# EAGLE board 000018 PGKB Rev 1.00 (EAGLE 9.3.0)
AUTHOR: Kallio Designs; DATE: 11.02.2019; PRODUCT_NUMBER: 000018; REVISION: 1.00; TITLE: PGKB
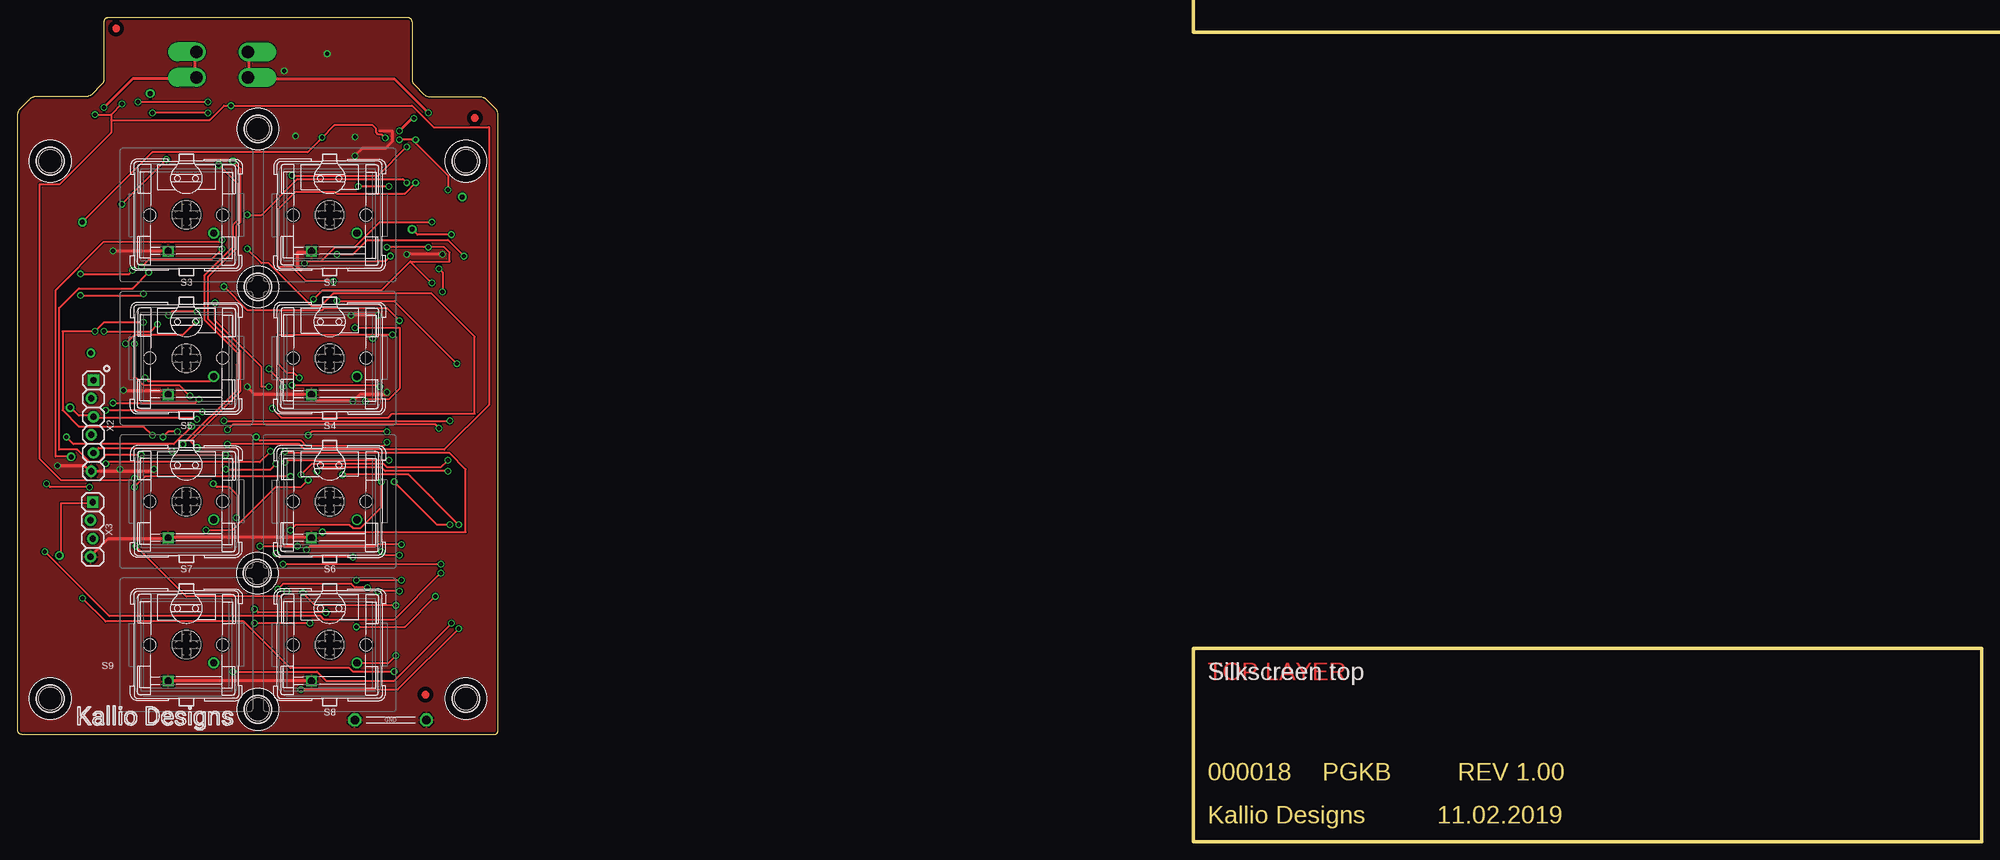
[diagram p8: board, top side]
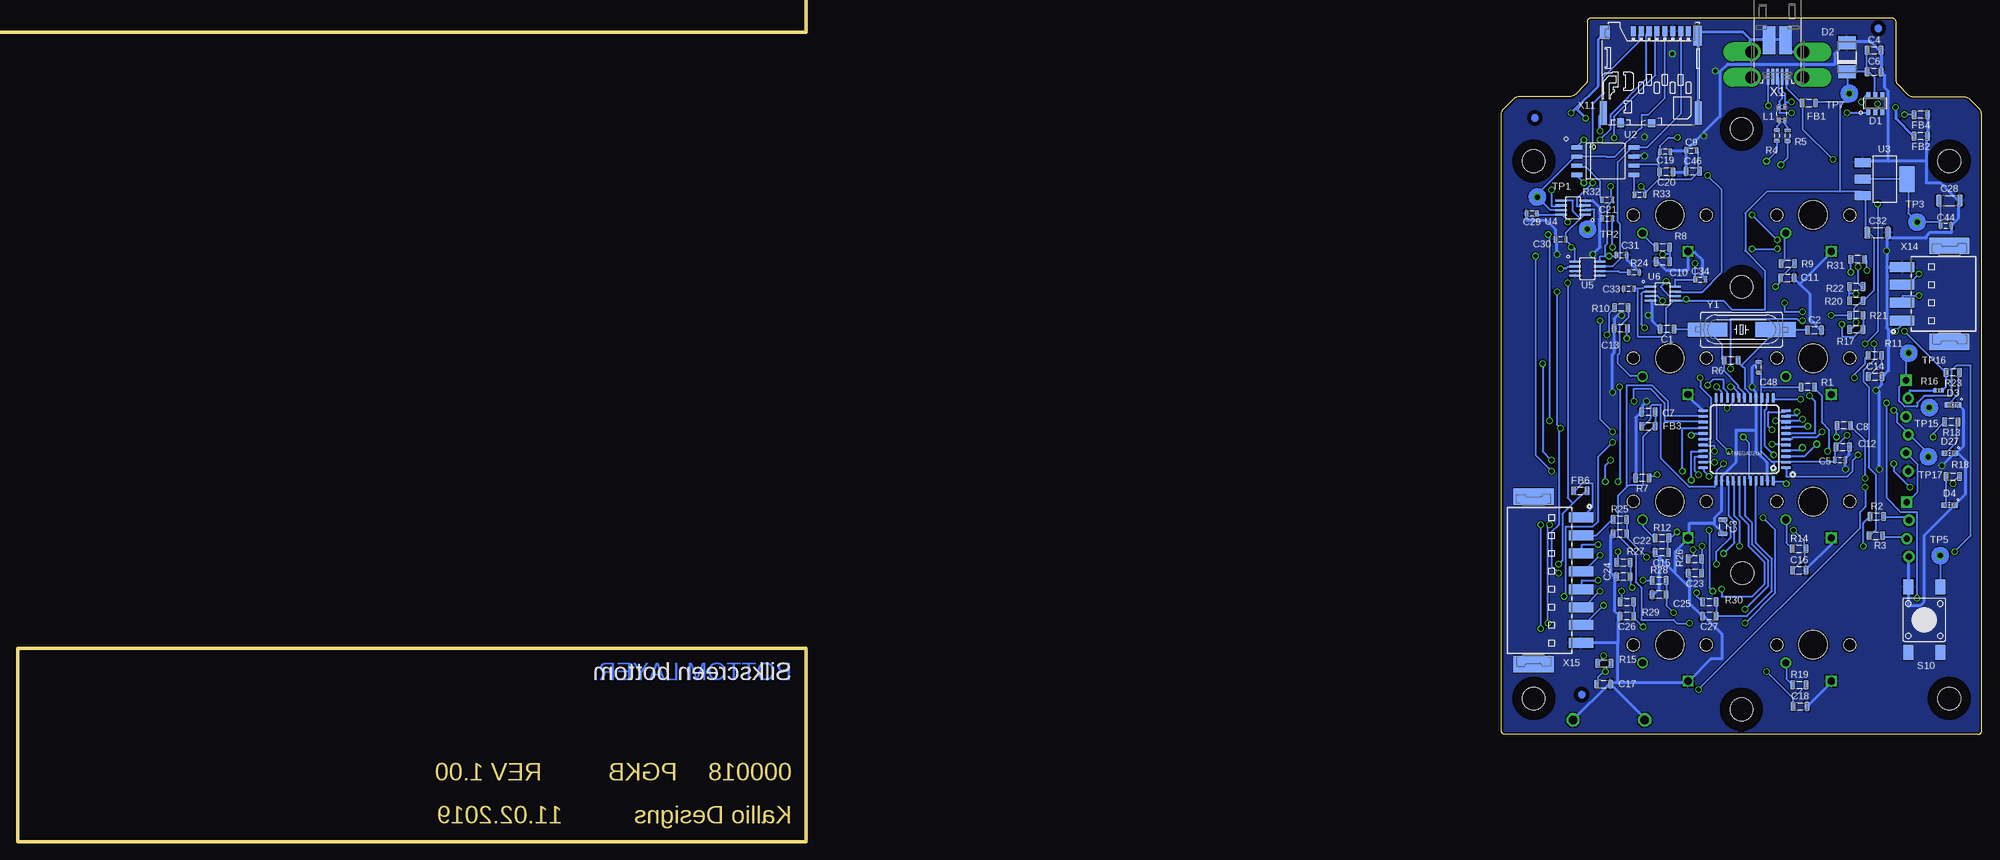
[diagram p9: board, bottom side, seen from below]

Size 274 x 115 mm. Coordinates in mm from the lower left corner, seen from the top.
Outline: 164,27 274,27 274,0 164,0 164,27
Outline: 55,114.5 55,106.5 arc45 55.35,105.65 56.65,104.35 arc45 57.5,104 64.5,104 arc-45 65.35,103.65 66.65,102.35 arc-45 67,101.5 67,15.5 arc-90 66.5,15 0.5,15 arc-90 0,15.5 0,101.5 arc-45 0.35,102.35 1.65,103.65 arc-45 2.5,104 9.5,104 arc45 10.35,104.35 11.65,105.65 arc45 12,106.5 12,114.5 arc-90 12.5,115 54.5,115 arc-90 55,114.5
Copper layers (1*16): Top 0.035mm / dielectric 1.5mm / Bottom 0.035mm
Design rules "ITEADstudio_DRC": minimum track width 6mil, minimum drill 12mil, track to track 6mil, track to pad 6mil, pad to pad 6mil, via to via 6mil, smd to smd 0mil, copper to edge 10mil, drill to drill 10mil, minimum pad ring 10mil, minimum via ring 6mil, stop-mask expansion 2mil, vias tented up to drill 100mil, thermal gap 10mil
Net classes: 0 default: width 0.15 mm; 1 PWR: width 0.4 mm; 2 +5V: drill 0.5 mm; 3 Serial: clearance 0.15 mm; 4 +3v3: drill 0.5 mm
Milling: 47 lines

## Footprints (pad centres in the part's own frame; a part is rotated, then mirrored left to right if it is on the bottom)
CAPC2012X160 = smd 0.7 x 1.3: P$1 -0.95,0; P$2 0.95,0
CAPC1608X90 = smd 0.5 x 0.9: P$1 -0.75,0; P$2 0.75,0
CAPC3216X200 = smd 0.9 x 1.7: P$1 -1.45,0; P$2 1.45,0
SOP95P280X120-6N = smd 0.55 x 0.8: 1 -0.95,-1.2; 2 0,-1.2; 3 0.95,-1.2; 4 0.95,1.2; 5 0,1.2; 6 -0.95,1.2
DIOC530X280X230_SMA_A = smd 1.8 x 2.4: A 2.025,0; C -2.025,0
LEDM1608X80N_DOME = smd 0.8 x 0.8: A -0.75,0; C 0.75,0
LEDM1608X80N = smd 0.8 x 0.8: A -0.75,0; C 0.75,0
RESC2012X50 = smd 0.7 x 1.3: P$1 -0.95,0; P$2 0.95,0
IND_CHOKE_EXC-34 = smd 0.75 x 0.4: A1 -0.925,0.4; A2 0.925,0.4; B1 -0.925,-0.4; B2 0.925,-0.4
RESC1608X45N = smd 0.5 x 0.9: P$1 -0.75,0; P$2 0.75,0
RESC1005X35N = smd 0.5 x 0.6: P$1 -0.5,0; P$2 0.5,0
SWITCH_BUTTON_CHERRY_MX = drill 1 square: 1 2.54,5.08 | drill 1: 2 -3.81,2.54 | hole 4: 0,0 | hole 1.7: 5.08,0; -5.08,0
SWITCH_BUTTON_TE_FSM4JSMA = smd 1.4 x 2.1: 1 2.25,4.55; 2 2.25,-4.55; 3 -2.25,4.55; 4 -2.25,-4.55
TEST_POINT_2.5MM_0.7HOLE_1SIDE = drill 0.7 pad 1.1: P$1 0,0
QFP80P1000X1000X120-44R_N = smd 1.4 x 0.45: 1 -5.8,4; 2 -5.8,3.2; 3 -5.8,2.4; 4 -5.8,1.6; 5 -5.8,0.8; 6 -5.8,0; 7 -5.8,-0.8; 8 -5.8,-1.6; 9 -5.8,-2.4; 10 -5.8,-3.2; 11 -5.8,-4; 23 5.8,-4; 24 5.8,-3.2; 25 5.8,-2.4; 26 5.8,-1.6; 27 5.8,-0.8; 28 5.8,0; 29 5.8,0.8; 30 5.8,1.6; 31 5.8,2.4; 32 5.8,3.2; 33 5.8,4 | smd 0.45 x 1.4: 12 -4,-5.8; 13 -3.2,-5.8; 14 -2.4,-5.8; 15 -1.6,-5.8; 16 -0.8,-5.8; 17 0,-5.8; 18 0.8,-5.8; 19 1.6,-5.8; 20 2.4,-5.8; 21 3.2,-5.8; 22 4,-5.8; 34 4,5.8; 35 3.2,5.8; 36 2.4,5.8; 37 1.6,5.8; 38 0.8,5.8; 39 0,5.8; 40 -0.8,5.8; 41 -1.6,5.8; 42 -2.4,5.8; 43 -3.2,5.8; 44 -4,5.8
SOP127P800X175-8 = smd 0.6 x 1.55: 1 -1.905,-4; 2 -0.635,-4; 3 0.635,-4; 4 1.905,-4; 5 1.905,4; 6 0.635,4; 7 -0.635,4; 8 -1.905,4
SOT223 = smd 1.219 x 2.235: 1 -2.311,-3.099; 2 0,-3.099; 3 2.311,-3.099 | smd 3.6 x 2.2: 4 0,3.099
SOP65P400X130-8 = smd 0.3 x 1.6: 1 -0.975,-1.7; 2 -0.325,-1.7; 3 0.325,-1.7; 4 0.975,-1.7; 5 0.975,1.7; 6 0.325,1.7; 7 -0.325,1.7; 8 -0.975,1.7
CON_USB_MICROB_UJ2-MIBH-4-SMT-TR_MAN = smd 2.2 x 0.4: D+ 8.1,0; D- 8.1,0.65; GND 8.1,-1.3; ID 8.1,-0.65; VBUS 8.1,1.3 | smd 3.9 x 1.8: G1 3,1.15; G2 3,-1.15 | drill 1.75 pad 2.2 offset: H1 8.2,3.6; H2 4.65,3.6; H3 4.65,-3.6; H4 8.2,-3.6
CON_PINHD_1X06_TH_OFFSET = drill 0.9 pad 1.6 square: 1 0.15,6.35 | drill 0.9 pad 1.6: 2 -0.15,3.81; 3 0.15,1.27; 4 -0.15,-1.27; 5 0.15,-3.81; 6 -0.15,-6.35
1X04_TH_OFFSET = drill 0.9 pad 1.6 square: 1 0.15,3.81 | drill 0.9 pad 1.6: 2 -0.15,1.27; 3 0.15,-1.27; 4 -0.15,-3.81
MTG_NP_M3_320X600 = hole 3.2: 0,0
CON_MICROSD_MOLEX_5033981892_M = smd 0.7 x 1.4: 1 4.405,-0.75; 2 5.505,-0.75; 3 6.605,-0.75; 4 7.705,-0.75; 5 8.805,-0.75; 6 9.905,-0.75; 7 11.005,-0.75; 8 12.105,-0.75 | smd 0.9 x 1.23: DET_LVR 2.66,-13.515 | smd 1.05 x 1.088: DET_SW 6.925,-13.59 | smd 1.44 x 1.83: H1 0.42,-0.915 | smd 1 x 3.33: H2 0.2,-12.165; H4 13.46,-12.165 | smd 1.16 x 2.8: H3 13.38,-1.4
PAD_GND_HOOK_M = drill 1.2 pad 1.8 octagon: P$1 -5,0; P$2 5,0
CON_PHOENIX_CONTACT_1702474 = smd 1.4 x 3.4: 1 -3.75,6.6; 2 -1.25,6.6; 3 1.25,6.6; 4 3.75,6.6 | smd 2.3 x 5.6: H1 -6.7,0; H2 6.7,0
CON_PHOENIX_CONTACT_1771088 = smd 1.4 x 3.4: 1 -8.75,6.6; 2 -6.25,6.6; 3 -3.75,6.6; 4 -1.25,6.6; 5 1.25,6.6; 6 3.75,6.6; 7 6.25,6.6; 8 8.75,6.6 | smd 2.3 x 5.6: H1 -11.7,0; H2 11.7,0
OSC_CRYSTAL_HC49/US = smd 5.6 x 2.1: 1 -4.75,0 | smd 5.5 x 2: 2 4.75,0

## Placement (x,y rotation side)
C1  C0805_18PF_50V_NP0  [CAPC2012X160]  43.89,71.59 180 bottom
C2  C0805_18PF_50V_NP0  [CAPC2012X160]  23.3,71.41 0 bottom
C3  C0805_1UF_50V_X5R  [CAPC2012X160]  36.09,43.99 270 bottom
C4  C0805_1UF_50V_X5R  [CAPC2012X160]  15,110.5 0 bottom
C5  C0603_100NF_50V_X7R  [CAPC1608X90]  19.75,53.3 0 bottom
C6  C0805_10NF_50V_X7R  [CAPC2012X160]  15,107.5 0 bottom
C7  C0805_1UF_50V_X5R  [CAPC2012X160]  46.5,60 180 bottom
C8  C0805_1UF_50V_X5R  [CAPC2012X160]  19.25,58.09 180 bottom
C9  C0603_100NF_50V_X7R  [CAPC1608X90]  40.5,96.5 0 bottom
C10  C0805_1NF_50V_X7R  [CAPC2012X160]  44.5,81 180 bottom
C11  C0805_1NF_50V_X7R  [CAPC2012X160]  27.09,78.73 0 bottom
C12  C0805_4.7UF_25V_X5R  [CAPC2012X160]  19.38,55.13 0 bottom
C13  C0805_1NF_50V_X7R  [CAPC2012X160]  50.33,71.67 180 bottom
C14  C0805_1NF_50V_X7R  [CAPC2012X160]  14.86,64.93 0 bottom
C15  C0805_1NF_50V_X7R  [CAPC2012X160]  44.64,40.39 180 bottom
C16  C0805_1NF_50V_X7R  [CAPC2012X160]  25.45,37.91 0 bottom
C17  C0805_1NF_50V_X7R  [CAPC2012X160]  52.74,22.01 0 bottom
C18  C0805_1NF_50V_X7R  [CAPC2012X160]  25.33,18.91 0 bottom
C19  C0603_100NF_50V_X7R  [CAPC1608X90]  44.15,96.3 180 bottom
C20  C0805_1UF_50V_X5R  [CAPC2012X160]  44,93.5 180 bottom
C21  C0603_100NF_50V_X7R  [CAPC1608X90]  52.25,87 0 bottom
C22  C0805_1NF_50V_X7R  [CAPC2012X160]  50.5,43 180 bottom
C23  C0805_1NF_50V_X7R  [CAPC2012X160]  40,37.5 180 bottom
C24  C0805_1NF_50V_X7R  [CAPC2012X160]  50,37 180 bottom
C25  C0805_1NF_50V_X7R  [CAPC2012X160]  45,34.5 180 bottom
C26  C0805_1NF_50V_X7R  [CAPC2012X160]  49.5,31.5 180 bottom
C27  C0805_1NF_50V_X7R  [CAPC2012X160]  38,31.5 180 bottom
C28  C1206_10UF_16V_Y5V  [CAPC3216X200]  4.5,89.5 0 bottom
C29  C0603_100NF_50V_X7R  [CAPC1608X90]  62.75,87.7 180 bottom
C30  C0603_100NF_50V_X7R  [CAPC1608X90]  58.75,84.1 0 bottom
C31  C0603_100NF_50V_X7R  [CAPC1608X90]  50.25,81.9 0 bottom
C32  C1206_10UF_16V_Y5V  [CAPC3216X200]  14.5,85 0 bottom
C33  C0603_100NF_50V_X7R  [CAPC1608X90]  49.25,77.2 0 bottom
C34  C0603_100NF_50V_X7R  [CAPC1608X90]  39.25,78.5 0 bottom
C44  C0603_100NF_50V_X7R  [CAPC1608X90]  5,86 0 bottom
C46  C0805_1UF_50V_X5R  [CAPC2012X160]  40.3,93.6 0 bottom
C48  C0603_100NF_50V_X7R  [CAPC1608X90]  31.1,66.25 90 bottom
D1  DIODE_TVS_5V_BI_824015  [SOP95P280X120-6N]  14.83,103.05 0 bottom
D2  DIODE_TVS_5V_SMAJ5.0A  [DIOC530X280X230_SMA_A]  18.78,109.52 90 bottom
D3  LED_0603_GREEN_CLEAR_APTD1608CGCK  [LEDM1608X80N_DOME]  4,61 0 bottom
D4  LED_0603_AMBER_DIFF_LOQ976-PS-25  [LEDM1608X80N]  4.5,47 0 bottom
D27  LED_0603_AMBER_DIFF_LOQ976-PS-25  [LEDM1608X80N]  4.44,54.25 0 bottom
ENCLOSURE1  ENCLOSURE_BOPLA_BOP-500-9005-TOP  [ENCLOSURE_BOPLA_BOP-500-9005]  33.5,57.5 180 top
FB1  FERRITE_0805_0A5  [RESC2012X50]  24.09,103.13 0 bottom
FB2  FERRITE_0805_0A5  [RESC2012X50]  8.5,98.5 180 bottom
FB3  FERRITE_0805_0A5  [RESC2012X50]  46.5,58 0 bottom
FB4  FERRITE_0805_0A5  [RESC2012X50]  8.5,101.5 180 bottom
FB6  FERRITE_0805_0A5  [RESC2012X50]  56,49 0 bottom
FIDUCIAL1  FIDUCIAL  [FIDUCIAL]  14.41,113.53 0 bottom
FIDUCIAL2  FIDUCIAL  [FIDUCIAL]  56.87,20.53 0 top
FIDUCIAL3  FIDUCIAL  [FIDUCIAL]  62.33,101.03 0 bottom
FIDUCIAL4  FIDUCIAL  [FIDUCIAL]  55.79,20.53 0 bottom
FIDUCIAL5  FIDUCIAL  [FIDUCIAL]  63.75,101.03 0 top
FIDUCIAL6  FIDUCIAL  [FIDUCIAL]  13.71,113.53 0 top
H1  SWITCH_CAP_DSA_RELEG  [SWITCH_CAP_DSA_RELEG]  23.5,67.5 180 top
H2  SWITCH_CAP_DSA_RELEG  [SWITCH_CAP_DSA_RELEG]  43.5,67.5 180 top
H3  SWITCH_CAP_DSA_RELEG  [SWITCH_CAP_DSA_RELEG]  43.5,87.5 180 top
H4  SWITCH_CAP_DSA_RELEG  [SWITCH_CAP_DSA_RELEG]  43.5,47.5 180 top
H5  SWITCH_CAP_DSA_RELEG  [SWITCH_CAP_DSA_RELEG]  43.5,27.5 180 top
H6  SWITCH_CAP_DSA_RELEG  [SWITCH_CAP_DSA_RELEG]  23.5,27.5 180 top
H7  SWITCH_CAP_DSA_RELEG  [SWITCH_CAP_DSA_RELEG]  23.5,87.5 180 top
H8  SWITCH_CAP_DSA_RELEG  [SWITCH_CAP_DSA_RELEG]  23.5,47.5 180 top
L1  L_CHOKE_EXC-34CE670U  [IND_CHOKE_EXC-34]  27.85,101.63 90 bottom
LOGO2  ART_LOGO_TEXT_2.5MM-SILK  [ART_LOGO_TEXT_2.5MM_SILK]  19.56,17.52 0 top
R1  R0805_10K_5%  [RESC2012X50]  24.26,63.49 180 bottom
R2  R0805_1K_1%  [RESC2012X50]  14.63,45.41 0 bottom
R3  R0805_1K_1%  [RESC2012X50]  14.76,42.72 0 bottom
R4  R0603_22  [RESC1608X45N]  28.58,98.58 270 bottom
R5  R0603_22  [RESC1608X45N]  27.08,98.54 270 bottom
R6  R0805_1M_5%  [RESC2012X50]  34.95,67.22 0 bottom
R7  R0805_10K_5%  [RESC2012X50]  47.36,50.78 180 bottom
R8  R0805_200_1%  [RESC2012X50]  44.5,83 0 bottom
R9  R0805_200_1%  [RESC2012X50]  27.02,80.72 0 bottom
R10  R0805_200_1%  [RESC2012X50]  50.29,74.59 180 bottom
R11  R0805_200_1%  [RESC2012X50]  14.9,67.91 0 bottom
R12  R0805_200_1%  [RESC2012X50]  44.59,42.41 0 bottom
R13  R0805_1K_1%  [RESC2012X50]  4.22,58.59 180 bottom
R14  R0805_200_1%  [RESC2012X50]  25.47,40.91 0 bottom
R15  R0805_200_1%  [RESC2012X50]  52.66,24.91 0 bottom
R16  R0402_DNP  [RESC1005X35N]  6,63 0 bottom
R17  R0805_3K3_1%  [RESC2012X50]  17.5,71.5 180 bottom
R18  R0805_1K_1%  [RESC2012X50]  4,51 0 bottom
R19  R0805_200_1%  [RESC2012X50]  25.42,21.91 0 bottom
R20  R0805_3K3_1%  [RESC2012X50]  17.5,75.5 0 bottom
R21  R0805_200_1%  [RESC2012X50]  17.5,73.5 180 bottom
R22  R0805_200_1%  [RESC2012X50]  17.5,77.5 0 bottom
R23  R0805_1K_1%  [RESC2012X50]  4,65.5 180 bottom
R24  R0603_0  [RESC1608X45N]  48.5,79.5 0 bottom
R25  R0805_1K_1%  [RESC2012X50]  50.5,45 0 bottom
R26  R0805_1K_1%  [RESC2012X50]  40,39.5 0 bottom
R27  R0805_1K_1%  [RESC2012X50]  50,39 0 bottom
R28  R0805_1K_1%  [RESC2012X50]  45,36.5 0 bottom
R29  R0805_1K_1%  [RESC2012X50]  49.5,33.5 0 bottom
R30  R0805_1K_1%  [RESC2012X50]  38,33.5 0 bottom
R31  R0805_200_1%  [RESC2012X50]  17.3,81.3 180 bottom
R32  R0603_0  [RESC1608X45N]  52.25,89.6 0 bottom
R33  R0603_0  [RESC1608X45N]  47.75,90.3 0 bottom
S1  SWITCH_BUTTON_MX1A-C1NW  [SWITCH_BUTTON_CHERRY_MX]  43.5,87.5 180 top
S3  SWITCH_BUTTON_MX1A-C1NW  [SWITCH_BUTTON_CHERRY_MX]  23.5,87.5 180 top
S4  SWITCH_BUTTON_MX1A-C1NW  [SWITCH_BUTTON_CHERRY_MX]  43.5,67.5 180 top
S5  SWITCH_BUTTON_MX1A-C1NW  [SWITCH_BUTTON_CHERRY_MX]  23.5,67.5 180 top
S6  SWITCH_BUTTON_MX1A-C1NW  [SWITCH_BUTTON_CHERRY_MX]  43.5,47.5 180 top
S7  SWITCH_BUTTON_MX1A-C1NW  [SWITCH_BUTTON_CHERRY_MX]  23.5,47.5 180 top
S8  SWITCH_BUTTON_MX1A-C1NW  [SWITCH_BUTTON_CHERRY_MX]  43.5,27.5 180 top
S9  SWITCH_BUTTON_MX1A-C1NW  [SWITCH_BUTTON_CHERRY_MX]  23.5,27.5 180 top
S10  SWITCH_MOM_SPST_FSM4JSMA  [SWITCH_BUTTON_TE_FSM4JSMA]  8,31 0 bottom
TP1  PAD_TEST_POINT-2.5/0.7_A  [TEST_POINT_2.5MM_0.7HOLE_1SIDE]  62,90 0 bottom
TP2  PAD_TEST_POINT-2.5/0.7_A  [TEST_POINT_2.5MM_0.7HOLE_1SIDE]  55,85.5 0 bottom
TP3  PAD_TEST_POINT-2.5/0.7_A  [TEST_POINT_2.5MM_0.7HOLE_1SIDE]  9,86.5 180 bottom
TP5  PAD_TEST_POINT-2.5/0.7_A  [TEST_POINT_2.5MM_0.7HOLE_1SIDE]  5.78,39.94 90 bottom
TP7  PAD_TEST_POINT-2.5/0.7_A  [TEST_POINT_2.5MM_0.7HOLE_1SIDE]  18.47,104.45 270 bottom
TP15  PAD_TEST_POINT-2.5/0.7_A  [TEST_POINT_2.5MM_0.7HOLE_1SIDE]  7.28,60.6 270 bottom
TP16  PAD_TEST_POINT-2.5/0.7_A  [TEST_POINT_2.5MM_0.7HOLE_1SIDE]  10.18,68.22 0 bottom
TP17  PAD_TEST_POINT-2.5/0.7_A  [TEST_POINT_2.5MM_0.7HOLE_1SIDE]  7.42,53.74 270 bottom
U1  IC_MCU_ATMEGA32U4-AU  [QFP80P1000X1000X120-44R_N]  33.06,56.19 180 bottom
U2  IC_MEM_FLASH_AT45DB321E  [SOP127P800X175-8]  52.5,95 270 bottom
U3  IC_REG_3V3_1A_NCP1117LPST33T3G  [SOT223]  13.5,92.5 270 bottom
U4  IC_LEVEL_SHIFTER_SN74LVC2T45  [SOP65P400X130-8]  57,88.5 90 bottom
U5  IC_LEVEL_SHIFTER_SN74LVC2T45  [SOP65P400X130-8]  55,80 270 bottom
U6  IC_LEVEL_SHIFTER_SN74LVC2T45  [SOP65P400X130-8]  44.5,76.5 270 bottom
X1  CON_USB_MICROB_UJ2-MIBH-4-SMT-TR-MAN  [CON_USB_MICROB_UJ2-MIBH-4-SMT-TR_MAN]  28.5,114.9 270 bottom
X2  CON_PROG_AVR_ISP-OFFSET_1X06  [CON_PINHD_1X06_TH_OFFSET]  10.38,58.08 0 top
X3  CON_1X04_TH_OFFSET_PADS-SILK  [1X04_TH_OFFSET]  10.29,43.59 0 top
X4  HOL_3.2/6.0_NP  [MTG_NP_M3_320X600]  62.5,20 180 top
X5  HOL_3.2/6.0_NP  [MTG_NP_M3_320X600]  33.5,18.5 180 top
X6  HOL_3.2/6.0_NP  [MTG_NP_M3_320X600]  4.5,95 180 top
X9  HOL_3.2/6.0_NP  [MTG_NP_M3_320X600]  4.5,20 180 top
X10  HOL_3.2/6.0_NP  [MTG_NP_M3_320X600]  62.5,95 180 top
X11  CON_MICROSD_MOLEX_5033981892-M  [CON_MICROSD_MOLEX_5033981892_M]  53,113.9 0 bottom
X12  HOL_3.2/6.0_NP  [MTG_NP_M3_320X600]  33.5,99.5 180 top
X13  PAD_TEST_GROUND_HOOK  [PAD_GND_HOOK_M]  52,17 180 top
X14  CON_CLAMP_PTSM_1X04_H_SMD  [CON_PHOENIX_CONTACT_1702474]  4.5,76.5 90 bottom
X15  CON_CLAMP_PTSM_1X08_H_SMD  [CON_PHOENIX_CONTACT_1771088]  62.5,36.5 270 bottom
X17  HOL_3.2/6.0_NP  [MTG_NP_M3_320X600]  33.4,37.48 180 top
X18  HOL_3.2/6.0_NP  [MTG_NP_M3_320X600]  33.48,77.48 180 top
Y1  OSC_CRYSTAL_16M_ABLS-16.000MHZ-B4-T-HC49  [OSC_CRYSTAL_HC49/US]  33.5,71.5 180 bottom

## Tracks (layer width: path | path; a pad name or v marks a point on that pad's centre or on a via)
!CS!_FLASH_3V3  (via drill 0.61)
  Top 0.254: v55.5,92 54,90.5 44.5,90.5 44.25,90.75 38.75,90.75 36.25,88.25 36.25,80.25 38.25,80.25 40.25,78.25 v44,78.25
  Bottom 0.254: U6.6 43.57,76.17 44.5,77.11 44.5,77.19 44.78,77.47 v44,78.25 | v55.5,92 56.5,93 U2.4
!CS!_FLASH_5V  (via drill 0.61)
  Top 0.254: v39.5,51.25 41,52.75 51,52.75 51.5,52.25 59,52.25 v60,53.25 | v61.25,66.75 52.5,75.5 v44.5,75.5
  Bottom 0.254: v39.5,51.25 40,51.75 40,53.75 39,53.75 U1.31 | v60,53.25 61.25,54.5 v61.25,66.75 | v44.5,75.5 45.25,76.25 46,76.25 U6.3
!CS!_SD_3V3  (via drill 0.61)
  Top 0.254: v54.25,97 50.25,93 v38.25,93
  Bottom 0.254: v54.25,97 54.25,103 52.75,104.5 52.75,106.75 47.75,111.75 47.75,112.75 47.5,113 X11.2 | v38.25,93 36.25,91 36.25,79.5 39,76.75 42.75,76.75 U6.7
!CS!_SD_5V  (via drill 0.61)
  Top 0.254: v48.5,61.5 48.75,61.75 51.75,61.75 53.25,63.25 53.25,71.75 v47,71.75
  Bottom 0.254: v48.5,61.5 48.5,63.25 46.25,63.25 44.25,61.25 44.25,58.75 39,58.75 U1.25 | v47,71.75 47.5,72.25 47.5,76.5 47.25,76.75 46.25,76.75 U6.2
!RESET  (via drill 0.61)
  Top 0.254: TP5.P$1 6,40 6,47.25 10.25,47.25 X3.1 | X2.5 10.75,54.5 11.25,55 21,55 v21.5,54.5 22,54 v29,54
  Bottom 0.254: S10.1 5.75,39.75 TP5.P$1 | v21.5,54.5 21.25,54.75 21.25,57.5 22.25,58.5 22.25,62.25 23.25,63.25 R1.P$1 | v29,54 30.25,55.25 30.25,60.25 30,60.5 30,61.75 U1.13 | X3.1 10.25,47.5 9,48.75 9,52.75 10.5,54.25 X2.5
!RESET!_3V3
  Bottom 0.254: R32.P$1 53,89.75 53.25,90 53.25,92.25 55.25,94.25 56.5,94.25 U2.3
+3V3  (via drill 0.61)
  Top 0.254: v40,80.75 40.25,81 42.25,81 | 42.25,81 51.25,81 v52,81.75 | v57.75,86.5 50.5,86.5 47,83 44.25,83 42.25,81 | TP3.P$1 18.75,96.25 40.4,96.25 v42.45,98.3 44.15,100 49.5,100 49.97,99.53 49.97,99.03 50.28,98.72 50.78,98.72 v51.25,98.25 | v47.5,91.5 v51.75,91.5
  Bottom 0.254: C29.P$1 62,87.5 58.75,87.5 U4.8 58.5,87.5 57.75,86.75 v57.75,86.5 | U6.8 42.75,77.5 42.75,78.5 C34.P$1 v40,80.75 | 52.5,81.75 53.25,81.75 53.25,81 U5.8 | 52.5,81.75 v52,81.75 51,81.75 C31.P$1 | 52.5,81.75 52.5,83.25 52.25,83.5 52.25,88.75 51.5,89.5 R32.P$2 51.5,89.75 51.75,90 v51.75,91.5 | 5.75,86.5 5.75,89.5 C28.P$1 | 5.75,86.5 C44.P$1 | 5.75,86.5 TP3.P$1 10.25,87.75 10.25,92.5 U3.4 U3.2 | C9.P$2 39.5,96.25 39.5,93.75 C46.P$2 39.5,93.5 40.5,92.5 45,92.5 | 45,93.5 45,94.5 | 45,94.5 45,96.25 C19.P$2 44.9,97.1 43.7,98.3 v42.45,98.3 | 45,92.5 46.75,90.75 | 46.75,90.75 47,90.5 R33.P$2 | 45,93.5 45,92.5 | 45,93.5 C20.P$2 | v51.25,98.25 51.25,101.25 45.5,107 45.5,113 X11.4 | 45,94.5 48.5,94.5 U2.6 | 46.75,90.75 v47.5,91.5
+5V  (via drill 0.61)
  Top 0.254: v36,52.75 35.25,52 v29,52 | v59,38.75 v37,38.75 | v51.5,83 v57.25,83 59.5,83 60.25,82.25 60.25,81 54.75,81 | v17.5,72.5 12,72.5 v10.75,71.25 6.25,71.25 6.25,60.25 8.5,58 17.5,58 v18.75,56.75 | 54.75,81 50.75,77 42.5,77 v41.25,75.75 | 54.75,81 v57.75,78
  Bottom 0.254: FB3.P$1 47.25,58 46.25,59 46.25,60.75 46,61 44.75,61 44.75,53.5 40.75,49.5 37.25,49.5 37.25,50.25 U1.34 37,50.5 37,51.75 v36,52.75 | 30.75,63.5 30.75,62 U1.14 30.75,61.75 30.75,54.5 29.25,53 29,53 | 30.75,63.5 30.75,65.25 31,65.5 C48.P$1 | 30.75,63.5 25.25,63.5 R1.P$2 | 29,53 27.5,53 U1.2 20.5,53 C5.P$1 20.5,55 C12.P$1 20.25,55.25 v18.75,56.75 | 29,53 v29,52 | v37,38.75 37,40.5 35,42.5 35,43.75 36,44.75 C3.P$1 | v59,38.75 58.5,39.25 58.5,45.75 57,47.25 | 57,47.25 55.25,49 FB6.P$2 | 57,83 56.75,82.75 56.75,81 U5.1 | 57,83 58,84 C30.P$2 58,85 56,87 | v51.5,83 C21.P$2 | 57,83 v57.25,83 | 56,87 55.5,87.5 U4.1 | 56,87 57,88 57,89.5 58.5,89.5 U4.5 | 19.75,103.25 18.5,103.25 18.5,104.25 TP7.P$1 18.5,104.5 18.75,104.75 18.75,107.25 D2.C 18.75,107.5 16,107.5 | 19.75,103.25 23,103.25 FB1.P$2 | D1.5 15,104.25 15,106.75 15.75,107.5 C6.P$1 16,107.5 | 16,107.5 16,110.5 C4.P$1 | 48,77.25 47.25,77.25 47,77.5 46.25,77.5 U6.1 | 48,77.25 48.5,77.25 C33.P$2 | 48,77.25 48,70.5 44.5,70.5 44,71 44,74.5 43,75.5 U6.5 42.75,75.5 41.25,75.5 | R16.P$2 5,63.5 5,65.5 | 17.75,72.5 17.75,72 18.25,71.5 R17.P$2 | 17.75,72.5 17.75,74.5 16.75,75.5 R20.P$2 16.5,75.5 15,77 15,84.25 15.75,85 C32.P$1 16,85 16.25,85.25 16.25,89.75 16.5,90 U3.3 16.75,90.25 16.75,90.75 19.75,90.75 | v10.75,71.25 5,65.5 | 17.75,72.5 v17.5,72.5 | 5,65.5 R23.P$2 | 41.25,75.5 36,75.5 34.75,74.25 30.25,74.25 30.25,79.75 33,82.5 33,87.75 30,90.75 19.75,90.75 | 19.75,90.75 19.75,103.25 | 41.25,75.5 v41.25,75.75 | 57,47.25 57.75,48 v57.75,78
AD0  (via drill 0.61)
  Top 0.254: v36,40.25 36.5,39.75 v46.75,39.75
  Bottom 0.254: 49.5,43 49.5,45 R25.P$2 | v36,40.25 34.5,41.75 34.5,44.75 35.25,45.5 35.25,50.25 U1.36 | v46.75,39.75 49.5,42.5 49.5,43 | 49.5,43 C22.P$1
AD1  (via drill 0.61)
  Top 0.254: v39,41.25 v33.75,41.25
  Bottom 0.254: 39,39.5 39,37.5 C23.P$1 | v33.75,41.25 33.75,44.75 34.5,45.5 34.5,50.25 U1.37 | 39,39.5 v39,41.25 | 39,39.5 R26.P$2
AD4  (via drill 0.61)
  Top 0.254: v36.25,35.25 37,36 46.5,36 47,35.5 v48.75,35.5
  Bottom 0.254: 49,37 49,39 R27.P$2 | v36.25,35.25 36.25,34.25 32,34.25 30.25,36 30.25,39 32.5,41.25 32.5,44.25 33.75,45.5 33.75,50.25 U1.38 | v48.75,35.5 49,35.75 49,37 | 49,37 C24.P$1
AD5  (via drill 0.61)
  Top 0.254: v33,32.5 33.5,32 v43,32
  Bottom 0.254: 44,34.5 44,36.5 R28.P$2 | v33,32.5 29.75,35.75 29.75,39.25 32,41.5 32,44.5 33,45.5 33,50.25 U1.39 | v43,32 44,33 44,34.5 | 44,34.5 C25.P$1
AD6  (via drill 0.61)
  Top 0.254: v33.25,56.5 33.75,56 39.5,56 40.25,55.25 51,55.25 v51.5,55.75 | v58.25,34.25 54,30 v47.25,30
  Bottom 0.254: 48.5,31.5 48.5,33.5 R29.P$2 | v33.25,56.5 32.5,55.75 32.5,50.75 32.25,50.5 U1.40 | v51.5,55.75 53.5,53.75 53.5,44.75 54.25,44 58,44 58,34.5 v58.25,34.25 | v47.25,30 48.5,31.25 48.5,31.5 | 48.5,31.5 C26.P$1
AD7
  Bottom 0.254: 37,31.5 37,33.5 R30.P$2 | 37,31.5 32.75,31.5 29.25,35 29.25,39.5 31.5,41.75 31.5,50.25 U1.41 | 37,31.5 C27.P$1
BUTTON1  (via drill 0.61)
  Top 0.254: v41.75,51.75 42.25,52.25 50.75,52.25 51.25,51.75 v60,51.75 | v62.25,81.75 60,84 48.75,84 46.75,82 v44.5,82
  Bottom 0.254: 43.5,82 43.5,83 R8.P$2 | 43.5,82 43.5,81 C10.P$1 | v41.75,51.75 41.75,57.75 39,57.75 U1.26 | v60,51.75 62.25,54 v62.25,81.75 | 43.5,82 v44.5,82
BUTTON2  (via drill 0.61)
  Top 0.254: v40.5,56.75 41,57.25 v51.5,57.25 | v53.25,72.75 51.5,74.5 42.75,74.5 42.5,74.25 32,74.25 v28.75,77.5
  Bottom 0.254: R9.P$2 26.25,80.5 28,78.75 C11.P$1 28.25,78.5 28.25,78 v28.75,77.5 | v40.5,56.75 40.5,57 39,57 U1.27 | v51.5,57.25 53.25,59 v53.25,72.75
BUTTON3  (via drill 0.61)
  Top 0.254: 50,70.75 v49.5,70.25 | v52.25,70.75 50,70.75 | v39.25,64.75 38.5,65.5 37.5,65.5 36.25,66.75 36.25,70.75 50,70.75
  Bottom 0.254: v49.5,70.25 49.5,71.5 C13.P$1 | v52.25,70.75 52,71 52,73.75 51.25,74.5 R10.P$2 | v39.25,64.75 39.25,63.5 37.75,62 37.75,56.25 38.75,56.25 U1.28
BUTTON4
  Bottom 0.254: C14.P$1 15.75,65 14,66.75 14,67.75 R11.P$2
BUTTON5  (via drill 0.61)
  Top 0.254: v37.25,54.5 37.5,54.25 60.25,54.25 62.5,52 62.5,43.25 v42.5,43.25
  Bottom 0.254: C15.P$1 43.75,40.5 43.75,42.25 R12.P$2 43.5,42.25 v42.5,43.25 | v37.25,54.5 37.25,55.25 38.75,55.25 U1.29
BUTTON6  (via drill 0.61)
  Top 0.254: v40.5,50.5 39.5,49.5 36,49.5 30,43.5 v26.25,43.5
  Bottom 0.254: C16.P$1 26.25,38 24.75,39.5 24.75,40.75 R14.P$2 24.75,41 24.75,42 v26.25,43.5 | v40.5,50.5 40.5,54.5 39,54.5 U1.30
BUTTON7  (via drill 0.61)
  Top 0.254: v25.25,61.75 24.75,61.25 v13.25,61.25 | v9,34 12.25,30.75 31.5,30.75 38,24.25 46.25,24.25 46.75,23.75 v52.5,23.75
  Bottom 0.254: 52.5,24 53.5,23 53.5,22.25 C17.P$1 | 52.5,24 51.75,24.75 R15.P$2 | v25.25,61.75 29,61.75 U1.12 | v13.25,61.25 13.25,48 11.25,46 9,46 v9,34 | 52.5,24 v52.5,23.75
BUTTON8  (via drill 0.61)
  Top 0.254: v37.25,53 37.5,53.25 v51.75,53.25 | v52.5,50.25 58.5,44.25 v60.25,44.25 | v60.5,30.5 52.5,22.5 43,22.5 41.75,23.75 v30,23.75
  Bottom 0.254: 26.25,20 24.5,21.75 R19.P$2 | 26.25,20 26.25,19 C18.P$1 | v37.25,53 38.75,53 U1.32 | v51.75,53.25 52.5,52.5 v52.5,50.25 | v60.25,44.25 60.5,44 v60.5,30.5 | 26.25,20 v30,23.75
CLK_3V3
  Bottom 0.254: X11.5 44.2,103.82 46.51,101.5 47.4,101.5 47.4,99.7 47.56,99.54 47.7,99.54 48.19,99.05 48.19,98.91 49,98.1 49.1,98.1 49.7,97.5 49.7,97.1 51.16,95.64 52.38,95.64 52.5,95.64 U2.2 56.77,95.64 62,90.41 TP1.P$1 60.17,88.17 U4.7
CLK_5V  (via drill 0.61)
  Top 0.254: v25,59 24.75,59.25 10.75,59.25 X2.3 10.5,59.5 8.5,59.5 7.5,60.5 TP15.P$1 | TP2.P$1 55.75,84.75 v60.5,84.75 | v28.75,58.75 v60.25,58.75
  Bottom 0.254: TP2.P$1 54,86.5 54,88.25 55.25,88.25 U4.2 | v25,59 25,58.75 27.25,58.75 U1.9 27.5,58.75 v28.75,58.75 | v60.5,84.75 60.25,84.5 v60.25,58.75
GND  (via drill 0.61)
  Top 0.4: v14.75,63 20.25,63 20.75,62.5 S5.1 | v13.25,82.5 20.75,82.5 S3.1 | v47,95.75 48,96.75 51.25,96.75 52.25,97.75 52.25,99.25 50.5,99.25 | S9.1 21,22.5 40.75,22.5 S8.1 | v19,52 18.75,51.75 14.25,51.75 | 14.25,51.75 10.25,51.75 X2.6 10,51.75 9.25,52.5 v5.5,52.5 | X3.4 10.25,40 12.5,42.25 20.75,42.25 S7.1 21,42.5 40.75,42.5 S6.1 | 39.5,79.75 39,80.25 39,82.25 40.75,82.25 S1.1 | v50.25,73.5 v46.5,73.5 | v59.25,82 v54.25,82 | v32,63.5 33,62.5 40.75,62.5 S4.1 41,62.25 41.75,61.5 v46.75,61.5 47.75,62.5 51.25,62.5 v51.5,62.75 | 14.25,51.75 v14.25,52
  Bottom 0.4: 25.38,77.88 26,78.5 C11.P$2 | 25.38,77.88 24,76.5 24,73 22.5,71.5 C2.P$2 | 25.38,77.88 21,82.25 S3.1 | 13.25,84.25 13.25,85 C32.P$2 13.25,84.25 | 13.25,84.25 v13.25,82.5 13.25,80.25 | 13.25,80.25 13.25,71.75 13,71.5 13,65.75 13.75,65 C14.P$2 14,64.75 14,63.75 v14.75,63 14.5,63 14.25,62.75 v14.25,52 | 13.25,80.25 X14.4 | C20.P$1 41.25,93.5 C46.P$1 C9.P$1 | C9.P$1 43.25,96.5 C19.P$1 43.5,96.5 | 38.5,98.25 v38.75,98.5 | 50.25,100.25 X11.DET_LVR | v47,95.75 48.5,95.75 U2.7 | 14,107.5 14,110.5 C4.P$2 14.25,110.5 15.5,111.75 18.75,111.75 D2.A 19,111.5 20.5,110 20.5,108.5 35.5,108.5 36.5,107.5 36.5,101.25 C9.P$1 | 3.25,89.5 3.25,87 C44.P$2 4.25,85 7.25,85 7.75,84.5 7.75,84.25 13.25,84.25 | FB4.P$1 7.5,101.5 7.5,98.5 FB2.P$1 7.75,98.5 7.75,95 | 7.75,95 13,95 | 13,95 16.5,95 U3.1 | 3.25,89.5 5.75,92 7.75,92 7.75,95 | 3.25,89.5 C28.P$2 | 14,107.5 13.5,107 13.5,105.25 13,104.75 13,95 | 14,107.5 C6.P$2 | C22.P$2 51.5,43 51.75,42.75 51.75,37.5 51.25,37 C24.P$2 51,37 51.25,36.75 51.25,32.25 50.5,31.5 C26.P$2 50.75,31.5 50.75,27.75 | 50.75,27.75 X15.8 | C18.P$2 24.25,19 21,22.25 S9.1 | X13.P$2 47,17.25 51.75,22 C17.P$2 | 50.75,22.25 51.75,22.25 C17.P$2 | 50.75,22.25 41,22.25 S8.1 40.75,22.5 37.75,25.5 36.25,25.5 36.25,29 38.75,31.5 C27.P$2 39,31.5 40.75,33.25 40.75,35.5 | X13.P$1 52,22 C17.P$2 | 50.75,22.25 50.75,27.75 | C12.P$2 18.5,55 18.5,54 19,53.5 C5.P$2 v19,52 | D3.C 2.5,60.25 2.5,55.25 3.38,54.38 | 3.38,54.38 3.5,54.25 D27.C 3.75,54.25 v5.5,52.5 | 3.38,54.38 2.25,53.25 2.25,48.5 D4.C 8,42.75 8,33.5 8.5,33 10.25,33 S10.3 10.25,39.75 X3.4 | C16.P$2 24.5,38 21,41.5 21,42.25 S7.1 | R24.P$2 49.5,81.25 C31.P$2
  Bottom 0.4: 53.12,87.12 53.25,87.25 53.25,88.5 54.25,89.5 55.25,89.5 U4.4 | 53.12,87.12 C21.P$1 | C34.P$2 39,79 39,81.25 40,82.25 40.75,82.25 S1.1 41,82.25 41,79.75 44,79.75 45.25,81 C10.P$2 | v54.25,82 53.25,83 53.25,87 53.12,87.12 | C29.P$2 63.5,86.75 60.75,86.75 59.5,85.5 C30.P$1 59.5,84 59.25,83.75 v59.25,82 | C1.P$2 46,72.75 46,73.5 | 46,73.5 46,75.5 U6.4 | 50.25,74 50.38,73.88 | 50.38,73.88 51.25,73 51.25,71.75 C13.P$2 51.25,71.5 51.25,68.25 51.5,68 v51.5,62.75 | v46.5,73.5 46,73.5 | v50.25,73.5 50.25,73.75 50.38,73.88 | U1.23 39,60.25 40.75,62 40.75,62.25 S4.1 | R7.P$2 48.25,51 48.25,59.25 47.5,60 C7.P$2 47.25,60 47.25,61 v46.75,61.5 | C48.P$2 31.25,67 32,66.25 v32,63.5 32,63.25 31.5,62.75 31.5,62 U1.15 31.5,61.75 31.5,57.5 | 31.5,57.5 31.5,54.5 30,53 30,50.5 U1.43 | 37.38,44.38 37.5,44.5 40.75,44.5 40.75,42.5 S6.1 41,42.25 42.75,40.5 42.75,37.75 42.88,37.62 | 37.38,44.38 36.25,43.25 C3.P$2 | 37.38,44.38 37.25,44.5 37.25,45.25 36.25,46.25 36.25,50.25 U1.35 36.25,50.5 36.25,51 34.25,53 34.25,57.5 31.5,57.5 | 40.75,35.5 40.75,37.5 C23.P$2 | 40.75,35.5 42.88,37.62 | 42.88,37.62 44.88,39.62 | 44.88,39.62 45.5,40.25 C15.P$2 | C25.P$2 45.75,34.5 45,35.25 45,39.5 44.88,39.62
  other vias: 37.15,107.6 47.05,98.4 43.15,110
  pour Bottom: -24.5,126 -32,79.5 -26.5,-1 92.5,-10 102.5,45 85.5,124 -17.5,128 -22,128 -22.5,128
  pour Top: -19.5,124 -27,77.5 -21.5,-3 97.5,-12 107.5,43 90.5,122 -12.5,126 -17,126 -17.5,126
GND_E  (via drill 0.61)
  Top 0.4: v12,102.5 16,106.5 24.75,106.5 X1.H1 24.75,106.75 24.75,110.25 X1.H2 | v57.25,101.75 52.5,106.5 32.25,106.5 X1.H4 32.25,106.75 32.25,110.25 X1.H3 | v53.25,99.25 55,101 v55.25,101
  Bottom 0.4: v12,102.5 12,101 9.5,98.5 FB2.P$2 | 32.25,112 32.25,110.25 X1.H3 | 32.25,112 29.75,112 X1.G2 29.5,112 27.5,112 X1.G1 27.25,111.75 27.25,110.25 X1.H2 | v57.25,101.75 56.62,102.38 | 56.62,102.38 53.5,105.5 53.5,112 52.75,112.75 X11.H1 | v53.25,99.25 53.25,101.25 53,101.5 X11.H2 | 56.62,102.38 v55.25,101 | 32.25,112 33.25,113 39.12,113 X11.H3 39.54,112.42 X11.H4
INTERRUPT7  (via drill 0.61)
  Top 0.254: v18.25,79.5 16,77.25 8.5,77.25 5.75,74.5 5.75,54.75 8.25,54.75 10,53 11.25,53 12.25,54 v17.25,54
  Bottom 0.254: v18.25,79.5 R31.P$2 | v17.25,54 18,53.25 18,51.75 18.75,51 27.25,51 27.25,52 U1.1
MISO_3V3
  Bottom 0.254: X11.7 41.99,101.6 46.69,96.91 U2.8 48.77,96.91 50.78,94.9 50.78,86.58 50.42,86.22 50.42,81.39 51.48,80.33 U5.7
MISO_5V  (via drill 0.61)
  Top 0.254: v29.25,57.5 30,58.25 58.25,58.25 v58.75,57.75 | v58.75,80 59.25,79.5 v59.25,76.75 | v3.75,40.5 12.75,31.5 42.25,31.5 42.75,31 52.5,31 v59,37.5
  Bottom 0.254: TP16.P$1 10.25,68 10.5,67.75 10.5,64.5 X2.1 10.75,64.25 11.5,63.5 11.5,61.5 10.75,60.75 9,60.75 9,61.25 8,62.25 4.25,62.25 4.25,65.75 3.5,66.5 1.5,66.5 1.5,42.75 v3.75,40.5 | v29.25,57.5 29.75,58 29.75,60 27.5,60 U1.11 | v59.25,76.75 59.25,58.25 v58.75,57.75 59,57.5 59,44.25 60,43.25 60,38.5 v59,37.5 | v58.75,80 58,80 57.75,80.25 56.75,80.25 U5.2
MOSI_3V3  (via drill 0.61)
  Top 0.254: 55,98 v53.25,98 | v60,91 60,93 55,98 | 55,98 v55.5,98
  Bottom 0.254: v53.25,98 51.75,99.5 51.75,101.5 46.75,106.5 46.75,112.75 46.5,113 X11.3 | v55.5,98 56.5,97 U2.1 | v60,91 60,88.75 58.75,88.75 U4.6
MOSI_5V  (via drill 0.61)
  Top 0.254: v25.75,60 25.5,60.25 v12.25,60.25 | v54.25,92 53.75,92.5 39,92.5 34,87.5 v32,87.5 | v28.5,84 28.25,83.75 12,83.75 5.25,77 5.25,53.75 7.25,53.75 TP17.P$1
  Bottom 0.254: v25.75,60 25.75,59.5 27.25,59.5 U1.10 | v12.25,60.25 11.75,59.75 11.75,58.5 10.25,57 X2.4 10,56.75 7.5,54.25 7.5,53.75 TP17.P$1 | v54.25,92 56.5,89.75 56.5,88.75 55.5,88.75 U4.3 | v28.5,84 v32,87.5
N$1  (via drill 0.61)
  Top 0.254: v26.5,101.75 v18.75,101.75
  Bottom 0.254: X1.D+ 28.38,106.68 28.38,104.73 27.91,104.26 27.91,103.7 28.25,103.36 L1.A2 28.25,101.75 v26.5,101.75 | v18.75,101.75 16,101.75 D1.1
N$2  (via drill 0.61)
  Top 0.254: v26.5,103.25 v16.75,103.25
  Bottom 0.254: X1.D- 27.85,104.85 27.45,104.45 27.45,103.25 | 27.45,103.25 L1.B2 | v16.75,103.25 16.75,103.5 16,104.25 D1.6 | 27.45,103.25 v26.5,103.25
N$3  (via drill 0.61)
  Top 0.254: v27.25,50 27.75,49.5 29.5,49.5 30.75,48.25 30.75,45.25 v30.5,45.25 | v40.75,30.5 v33,30.5
  Bottom 0.254: C7.P$1 45.5,60 45.5,58 FB3.P$2 45.75,58 47.25,56.5 47.25,49.75 49.25,49.75 49.5,49.5 | v27.25,50 27.25,50.25 29,50.25 U1.44 | v30.5,45.25 28.75,43.5 28.75,34.75 v33,30.5 | v40.75,30.5 42.5,30.5 43,31 47.5,31 47.5,35.5 48.25,36.25 48.25,40.25 50.75,42.75 50.75,48.25 49.5,49.5 | 49.5,49.5 49.5,63.75 46,63.75 43.75,61.5 43.75,59.5 39,59.5 U1.24
N$4
  Bottom 0.254: D4.A 5,47.25 5,51 R18.P$1
N$5
  Bottom 0.254: C1.P$1 42.75,71.5 Y1.2 36.25,69.5 36.25,67.5 36,67.25 R6.P$1 36,67 36,65.75 34,63.75 34,63.5 33.25,62.75 33.25,62 U1.17
N$6
  Bottom 0.254: 33.5,66.5 33,66 33,63.25 32.25,62.5 U1.16 | 33.5,66.5 34,67 R6.P$2 | C2.P$1 24.25,71.5 Y1.1 28.75,71.25 33.5,66.5
N$7  (via drill 0.61)
  Top 0.254: v20.25,56.5 21,57.25 v22.25,57.25
  Bottom 0.254: v20.25,56.5 20.25,58 C8.P$2 | v22.25,57.25 23,56.5 26.25,56.5 26.5,56.25 27.25,56.25 U1.6
N$8
  Bottom 0.254: R2.P$2 13.5,45.25 10.25,45.25 10.25,45 X3.2
N$9
  Bottom 0.254: R3.P$2 13.75,42.5 10.5,42.5 X3.3
N$11  (via drill 0.61)
  Top 0.254: v45.25,51.25 54.5,51.25 v61.5,44.25 | v61.5,29.75 53,21.25 v39.5,21.25 | v16.25,49.5 17.75,51 v38,51
  Bottom 0.254: v45.25,51.25 45.25,51 46.25,51 R7.P$1 | v61.5,29.75 v61.5,44.25 | v39.5,21.25 17,43.75 17,46 16.25,46.75 v16.25,49.5 | v38,51 38.75,51.75 38.75,52 U1.33
N$12
  Bottom 0.254: D27.A 5,54.25 3.5,55.75 3.5,58.5 R13.P$1
N$13
  Bottom 0.254: R8.P$1 45.5,83 47.25,84.75 S1.2
N$14
  Bottom 0.254: R16.P$1 10,63 10,62 X2.2
N$15
  Bottom 0.254: R9.P$1 27.75,80.75 27.5,81 27.5,84.75 S3.2
N$16
  Bottom 0.254: R10.P$1 49.25,74.5 49.25,73.25 50.5,72 50.5,68.25 50.75,68 50.75,66.75 49,65 47.5,65 S4.2
N$17  (via drill 0.61)
  Top 0.254: v17.75,64.75 18.25,64.25 26.75,64.25 27.25,64.75 S5.2
  Bottom 0.254: v17.75,64.75 17.75,65.25 16.25,66.75 16.25,67.5 16,67.75 R11.P$1
N$18
  Bottom 0.254: R12.P$1 45.75,42.5 47.25,44 47.25,44.75 S6.2
N$19
  Bottom 0.254: R14.P$1 26.5,41 27.25,41.75 27.25,44.75 S7.2
N$20  (via drill 0.61)
  Top 0.254: v52.75,26 51.75,25 47.5,25 S8.2
  Bottom 0.254: v52.75,26 52.75,25.75 53.5,25 R15.P$1
N$21
  Bottom 0.254: R19.P$1 26.5,22 27.25,22.75 27.25,24.75 S9.2
N$22
  Bottom 0.254: L1.B1 27.45,100.15 27.08,99.78 R5.P$1
N$23
  Bottom 0.254: L1.A1 28.25,100.15 28.58,99.82 R4.P$1
N$24
  Bottom 0.254: U2.5 R33.P$1
N$25  (via drill 0.61)
  Top 0.254: v19.5,72.25 18.5,71.25 v12,71.25
  Bottom 0.254: R21.P$1 16.5,73.5 16.5,71.5 R17.P$1 16.75,71.5 17.75,70.5 19.5,70.5 v19.5,72.25 | v12,71.25 11.25,72 11.25,72.75 X14.1
N$26  (via drill 0.61)
  Top 0.254: v17.5,76.5 17.25,76.25 v8.75,76.25
  Bottom 0.254: 18.5,76.5 18.5,77.5 R22.P$1 | 18.5,76.5 18.5,75.5 R20.P$1 | v17.5,76.5 18.5,76.5 | v8.75,76.25 11,76.25 11,75.25 X14.2
N$27
  Bottom 0.254: D3.A 3.25,62.5 3.25,65.5 R23.P$1
N$28
  Bottom 0.254: U5.6 50.67,79.67 50.5,79.5 R24.P$1
N$29
  Bottom 0.254: FB6.P$1 56.75,49 55.75,50 54.25,50 54.25,46.75 55.75,45.25 X15.1
N$30  (via drill 0.61)
  Top 0.254: v50.75,40.5 51.25,40 v53.25,40
  Bottom 0.254: v50.75,40.5 50.75,39 R27.P$1 | v53.25,40 55.5,37.75 X15.4
N$31  (via drill 0.61)
  Top 0.254: v53.5,36.5 v47.25,36.5
  Bottom 0.254: v47.25,36.5 R28.P$1 | v53.5,36.5 55.75,36.5 55.75,35.25 X15.5
N$32  (via drill 0.61)
  Top 0.254: v16,79.75 15.5,79.25 v8.75,79.25
  Bottom 0.254: v16,79.75 16,81 16.25,81.25 R31.P$1 | v8.75,79.25 10.25,77.75 X14.3
N$36
  Bottom 0.254: X15.2 53.75,42.75 51.5,45 R25.P$1
N$37  (via drill 0.61)
  Top 0.254: v40.25,40.75 40.75,41.25 50,41.25 50.25,41.5 v53.5,41.5
  Bottom 0.254: v40.25,40.75 40.25,40 40.75,39.5 R26.P$1 | v53.5,41.5 55.75,41.5 55.75,40.25 X15.3
N$38  (via drill 0.61)
  Top 0.254: v53.25,35 v50.25,35
  Bottom 0.254: v50.25,35 50.25,33.5 R29.P$1 | v53.25,35 55.5,32.75 X15.6
N$39  (via drill 0.61)
  Top 0.254: v39.75,34.75 41.5,33 v52.75,33
  Bottom 0.254: v39.75,34.75 39.75,34.25 39,33.5 R30.P$1 | v52.75,33 55.5,30.25 X15.7
RX_LED  (via drill 0.61)
  Top 0.254: v6.75,56.5 7.75,55.5 21.75,55.5 v24.25,58
  Bottom 0.254: v6.75,56.5 6.75,57 5.25,58.5 R13.P$2 | v24.25,58 27.25,58 U1.8
RXD  (via drill 0.61)
  Top 0.254: v16.5,41.25 23.5,34.25 36.75,34.25 v37.5,35 | v38,43.5 38.75,44.25 46.25,44.25 46.75,43.75 47.75,43.75 50.75,46.75 v50.75,50.25 | v50.5,63.5 50.25,63.75 v38.25,63.75
  Bottom 0.254: v16.5,41.25 16.5,44.5 15.75,45.25 R2.P$1 | v37.5,35 38,35.5 v38,43.5 | v50.75,50.25 50.5,50.5 v50.5,63.5 | v38.25,63.75 37.5,64.5 36,64.5 36,63.25 35.5,62.75 35.5,62 U1.20
SCL_5V  (via drill 0.61)
  Top 0.254: v21,73.5 21.5,74 v25,74 | v27.5,75.25 27.5,72.75 34,66.25 34,63.5 v35,63.5
  Bottom 0.254: v21,73.5 R21.P$2 | v25,74 27.5,74 v27.5,75.25 | v35,63.5 34.5,63.5 34.5,63.25 34,62.75 34,62 U1.18
SDA_5V  (via drill 0.61)
  Top 0.254: v17.25,80.25 18.25,81.25 27,81.25 v28.5,82.75 | v32,82.75 34,80.75 35,80.75 41,74.75 42.25,74.75 44,76.5 57.75,76.5 63.75,70.5 63.75,59.75 52.25,59.75 51.75,59.25 36.75,59.25 v35.5,60.5
  Bottom 0.254: v17.25,80.25 17.25,78 16.75,77.5 R22.P$2 | v32,82.75 v28.5,82.75 | v35.5,60.5 34.75,61.25 34.75,61.75 U1.19
TX_LED  (via drill 0.61)
  Top 0.254: v4,50 4.5,49.5 v10,49.5 | v12.25,52.75 12.5,53 33.75,53 v35.25,54.5
  Bottom 0.254: v4,50 4,50.25 3.25,51 R18.P$2 | v10,49.5 12.25,51.75 v12.25,52.75 | v35.25,54.5 37,56.25 37,61.75 U1.22
TXD  (via drill 0.61)
  Top 0.254: v15,69.5 16.25,70.75 23,70.75 v25,72.75 | v35,66 37,64 v37,63.5
  Bottom 0.254: v15,69.5 15,67.25 16.5,65.75 16.5,64.25 15.75,63.5 15.75,52.25 14.75,51.25 14.75,43.5 15.5,42.75 R3.P$1 | v25,72.75 25.5,72.75 25.75,73 35,73 v35,66 | v37,63.5 36.25,62.75 U1.21
USB_D+  (via drill 0.61 pad 1)
  Top 0.254: v30,95 31.03,93.97 31.03,86.48 30.46,85.91 30.46,82.81 26.5,78.85 26.5,73.05 31.03,68.52 31.03,66.48 31,66.45 31,62.85 24.07,55.93 v25,55
  Bottom 0.254: R4.P$2 28.58,96.42 v30,95 | v25,55 25.41,54.59 U1.4
USB_D-  (via drill 0.61 pad 1)
  Top 0.254: v28,94.5 30.57,91.93 30.57,86.67 30,86.1 30,83 26,79 26,72.9 30.57,68.33 30.57,66.67 30.5,66.6 30.5,63 v23,55.5
  Bottom 0.254: R5.P$2 27.08,95.42 v28,94.5 | v23,55.5 24.71,53.79 U1.3
USB_GND  (via drill 0.61)
  Top 0.254: 13,101.5 v14.5,103 | v10.75,101.5 13,101.5 | v16.25,50.75 16,50.5 6,50.5 3,53.5 3,91.75 5.75,91.75 13,99 13,100.75 | 13,101.5 13,100.75 | v29.25,55.5 39.25,55.5 40,54.75 59.5,54.75 65.75,61 65.75,99.75 58,99.75 55,102.75 v29.75,102.75 28.75,102.75 26.75,100.75 13,100.75
  Bottom 0.254: v14.5,103 14.5,102.25 14.75,102 D1.2 | FB4.P$2 v10.75,101.5 | v16.25,50.75 16.25,56 18.25,58 C8.P$1 | v29.25,55.5 27.5,55.5 U1.5 | v29.75,102.75 29.75,106.75 X1.GND
USB_VBUS  (via drill 0.61)
  Top 0.254: v24,62.25 22.5,63.75 17.5,63.75 16.25,65 v16.25,69.5 | v20.75,95.25 v14.5,89
  Bottom 0.254: X1.VBUS 27.25,106.75 27.25,105.25 25.25,103.25 FB1.P$1 25,103 25,99.5 v20.75,95.25 | v24,62.25 23.25,61.5 23.25,57 U1.7 | v16.25,69.5 14.5,71.25 v14.5,89

## Text on the board
Top: TOP LAYER
Bottom: BOTTOM LAYER
Dimension: REV
tPlace: Silkscreen top
bPlace: Silkscreen bottom
tStop: Soldermask top
bStop: Soldermask bottom
tCream: Paste mask top
bCream: Paste mask bottom
Drills: Drill drawing
Milling: Drill tolerance < 2 mm drill | +/- 0.1 mm | Drill tolerance > 2 mm drill | +/- 10 % | General tolerances | IPC | Soldermask color | Silkscreen color | PCB Material | FR4 | Surface finish | HASL | PCB Final thickness (without mask) | 1.6 mm | PCB Build up: | L1: Top | Copper 35 um +/-10 % | FR4 core 1530 um +/-10 % | L2: Bottom | Copper 35 um +/-10 %